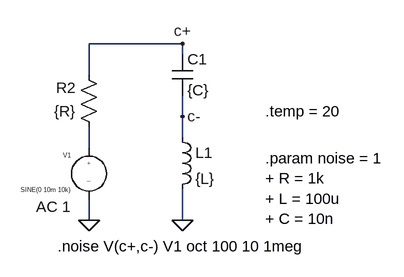
[diagram p0: schematic noise_rlc.asc]
noise_rlc.asc, the LTspice schematic file:
Version 4
SHEET 1 880 680
WIRE -192 -48 -336 -48
WIRE -192 -32 -192 -48
WIRE -336 0 -336 -48
WIRE -192 64 -192 32
WIRE -192 96 -192 64
WIRE -336 112 -336 80
WIRE -336 224 -336 192
WIRE -192 224 -192 176
FLAG -336 224 0
FLAG -192 224 0
FLAG -192 -48 c+
FLAG -192 64 c-
SYMBOL MDB_sym\\source-V -336 96 M0
WINDOW 123 28 107 Left 2
WINDOW 39 0 0 Left 2
SYMATTR Value2 AC 1
SYMATTR InstName V1
SYMATTR Value SINE(0 10m 10k)
SYMBOL res -320 96 R180
WINDOW 0 36 76 Left 2
WINDOW 3 36 40 Left 2
SYMATTR InstName R2
SYMATTR Value {R}
SYMBOL cap -208 -32 R0
SYMATTR InstName C1
SYMATTR Value {C}
SYMBOL ind -208 80 R0
SYMATTR InstName L1
SYMATTR Value {L}
TEXT -384 264 Left 2 !.noise V(c+,c-) V1 oct 100 10 1meg
TEXT -64 56 Left 2 !.temp = 20
TEXT -64 128 Left 2 !.param noise = 1\n+ R = 1k\n+ L = 100u\n+ C = 10n

The netlist it stands for:
* noise_rlc.asc
V1 N001 0 SINE(0 10m 10k) AC 1
R2 N001 c+ {R}
C1 c+ c- {C}
L1 c- 0 {L}
.noise V(c+,c-) V1 oct 100 10 1meg
.temp = 20
.param noise = 1
+ R = 1k
+ L = 100u
+ C = 10n
.backanno
.end